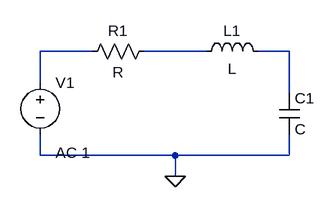
[diagram p0: schematic EA_EX4_Garrafa.asc]
EA_EX4_Garrafa.asc, the LTspice schematic file:
Version 4
SHEET 1 880 680
WIRE 32 64 -48 64
WIRE 208 64 112 64
WIRE 336 64 288 64
WIRE -48 112 -48 64
WIRE 336 128 336 64
WIRE -48 224 -48 192
WIRE 160 224 -48 224
WIRE 336 224 336 192
WIRE 336 224 160 224
WIRE 160 256 160 224
FLAG 160 256 0
SYMBOL voltage -48 96 R0
WINDOW 123 24 124 Left 2
WINDOW 39 0 0 Left 0
SYMATTR InstName V1
SYMATTR Value ""
SYMATTR Value2 AC 1
SYMBOL res 128 48 R90
WINDOW 0 0 56 VBottom 2
WINDOW 3 32 56 VTop 2
SYMATTR InstName R1
SYMBOL ind 192 80 R270
WINDOW 0 32 56 VTop 2
WINDOW 3 5 56 VBottom 2
SYMATTR InstName L1
SYMBOL cap 320 128 R0
SYMATTR InstName C1

The netlist it stands for:
* EA_EX4_Garrafa.asc
V1 N001 0 AC 1
R1 N002 N001 R
L1 N002 N003 L
C1 N003 0 C
.backanno
.end